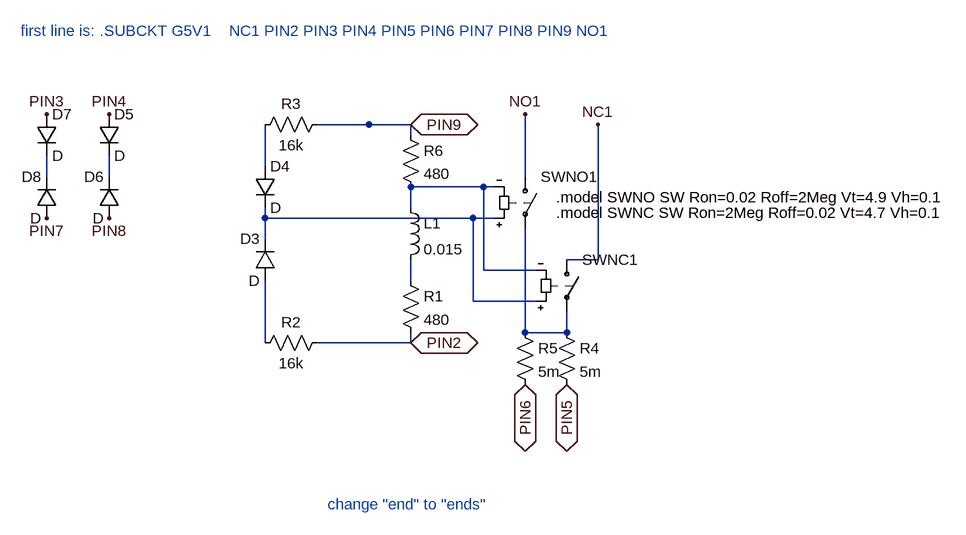
[diagram p0: schematic G5V1.asc]
G5V1.asc, the LTspice schematic file:
Version 4
SHEET 1 944 680
WIRE 64 0 -80 0
WIRE 64 16 64 0
WIRE -160 64 -160 0
WIRE -496 80 -496 48
WIRE -400 80 -400 48
WIRE 240 80 240 -16
WIRE 176 96 64 96
WIRE 192 96 176 96
WIRE 64 128 64 96
WIRE -160 144 -160 128
WIRE 160 144 -160 144
WIRE 192 144 160 144
WIRE -160 176 -160 144
WIRE 352 208 352 0
WIRE 352 208 304 208
WIRE 176 224 176 96
WIRE 256 224 176 224
WIRE 64 240 64 208
WIRE 160 272 160 144
WIRE 256 272 160 272
WIRE 240 320 240 160
WIRE 304 320 304 288
WIRE 304 320 240 320
WIRE -160 336 -160 240
WIRE 64 336 64 320
WIRE 64 336 -80 336
WIRE 0 0 0 0
FLAG 64 0 PIN9
IOPIN 64 0 BiDir
FLAG 64 336 PIN2
IOPIN 64 336 BiDir
FLAG 352 0 NC1
FLAG 240 -16 NO1
FLAG 304 400 PIN5
IOPIN 304 400 BiDir
FLAG 240 400 PIN6
IOPIN 240 400 BiDir
FLAG -400 -16 PIN4
FLAG -400 144 PIN8
FLAG -496 144 PIN7
FLAG -496 -16 PIN3
SYMBOL ind 48 112 R0
SYMATTR InstName L1
SYMATTR Value 0.015
SYMBOL res 48 224 R0
SYMATTR InstName R1
SYMATTR Value 480
SYMBOL sw 240 64 R0
SYMATTR InstName SWNO1
SYMATTR SpiceModel SWNO
SYMATTR Value ""
SYMBOL diode -144 240 R180
WINDOW 0 24 64 Left 2
WINDOW 3 24 0 Left 2
SYMATTR InstName D3
SYMBOL diode -176 64 R0
SYMATTR InstName D4
SYMBOL res -64 320 R90
WINDOW 0 0 56 VBottom 2
WINDOW 3 32 56 VTop 2
SYMATTR InstName R2
SYMATTR Value 16k
SYMBOL sw 304 192 R0
SYMATTR InstName SWNC1
SYMATTR SpiceModel SWNC
SYMATTR Value ""
SYMBOL res -64 -16 R90
WINDOW 0 0 56 VBottom 2
WINDOW 3 32 56 VTop 2
SYMATTR InstName R3
SYMATTR Value 16k
SYMBOL diode -416 -16 R0
SYMATTR InstName D5
SYMBOL diode -384 144 R180
WINDOW 0 24 64 Left 2
WINDOW 3 24 0 Left 2
SYMATTR InstName D6
SYMBOL res 288 304 R0
SYMATTR InstName R4
SYMATTR Value 5m
SYMBOL res 224 304 R0
SYMATTR InstName R5
SYMATTR Value 5m
SYMBOL diode -512 -16 R0
SYMATTR InstName D7
SYMBOL diode -480 144 R180
WINDOW 0 24 64 Left 2
WINDOW 3 24 0 Left 2
SYMATTR InstName D8
SYMBOL res 48 0 R0
SYMATTR InstName R6
SYMATTR Value 480
TEXT 288 112 Left 2 !.model SWNO SW Ron=0.02 Roff=2Meg Vt=4.9 Vh=0.1
TEXT 288 136 Left 2 !.model SWNC SW Ron=2Meg Roff=0.02 Vt=4.7 Vh=0.1
TEXT -536 -144 Left 2 ;first line is: .SUBCKT G5V1    NC1 PIN2 PIN3 PIN4 PIN5 PIN6 PIN7 PIN8 PIN9 NO1
TEXT -64 584 Left 2 ;change "end" to "ends"

The netlist it stands for:
* G5V1.asc
L1 N004 N006 0.015
R1 N006 PIN2 480
SWNO1 NO1 N007 N005 N004 SWNO
D3 N008 N005 D
D4 N001 N005 D
R2 PIN2 N008 16k
SWNC1 NC1 N007 N005 N004 SWNC
R3 PIN9 N001 16k
D5 PIN4 N003 D
D6 PIN8 N003 D
R4 N007 PIN5 5m
R5 N007 PIN6 5m
D7 PIN3 N002 D
D8 PIN7 N002 D
R6 PIN9 N004 480
.model D D
.lib standard.dio
.model SWNO SW Ron=0.02 Roff=2Meg Vt=4.9 Vh=0.1
.model SWNC SW Ron=2Meg Roff=0.02 Vt=4.7 Vh=0.1
* first line is: .SUBCKT G5V1    NC1 PIN2 PIN3 PIN4 PIN5 PIN6 PIN7 PIN8 PIN9 NO1
* change "end" to "ends"
.backanno
.end